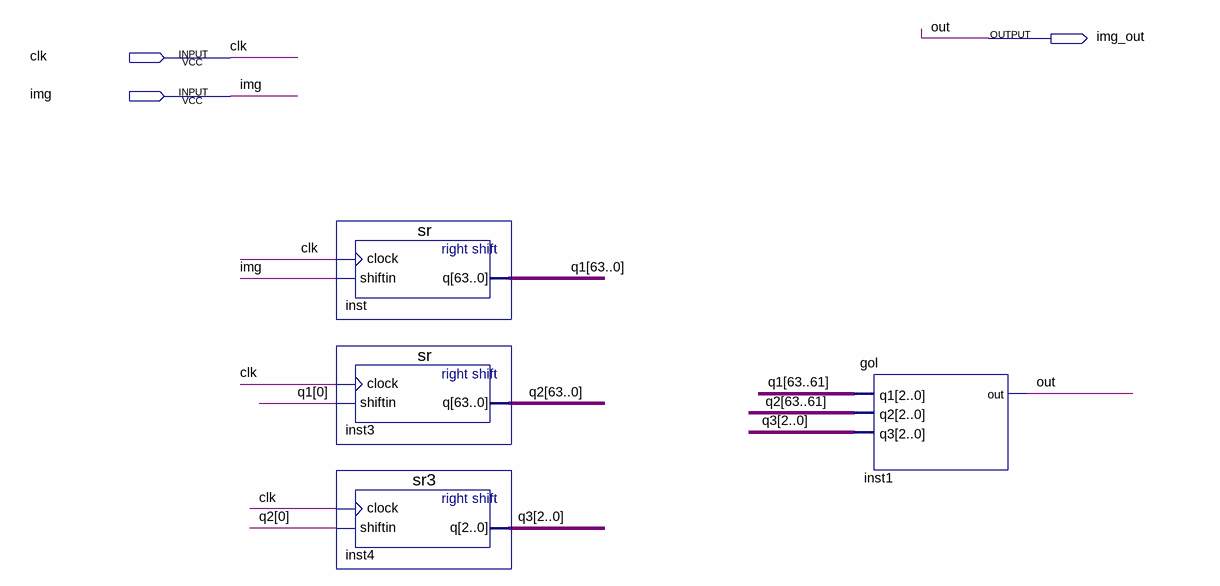
[diagram p0: schematic sheet]
// Quartus schematic estagio.bdf as structural Verilog: 4 symbols, 3 pins
module estagio (
  input  clk,
  input  img,
  output img_out
);

  wire [2:0] q3;
  wire [63:0] q1, q2;

  sr inst (.clock(clk), .shiftin(img), .q(q1));
  sr inst3 (.clock(clk), .shiftin(q1[0]), .q(q2));
  sr3 inst4 (.clock(clk), .shiftin(q2[0]), .q(q3));
  gol inst1 (.q1(q1[63:61]), .q2(q2[63:61]), .q3(q3), .out(img_out));

  // Other names for the same wires on the sheet: out = img_out
endmodule
